# Altium schematic sheet OPTIONAL.SchDoc: 005 E-BIKE CHGARGER
size A3; Author: Oriol Cos; CompanyName: MPS; Engineer: Oriol Cos; Organization: APP BCN; Revision: V1.2; SheetNumber: 5; SheetTotal: 5
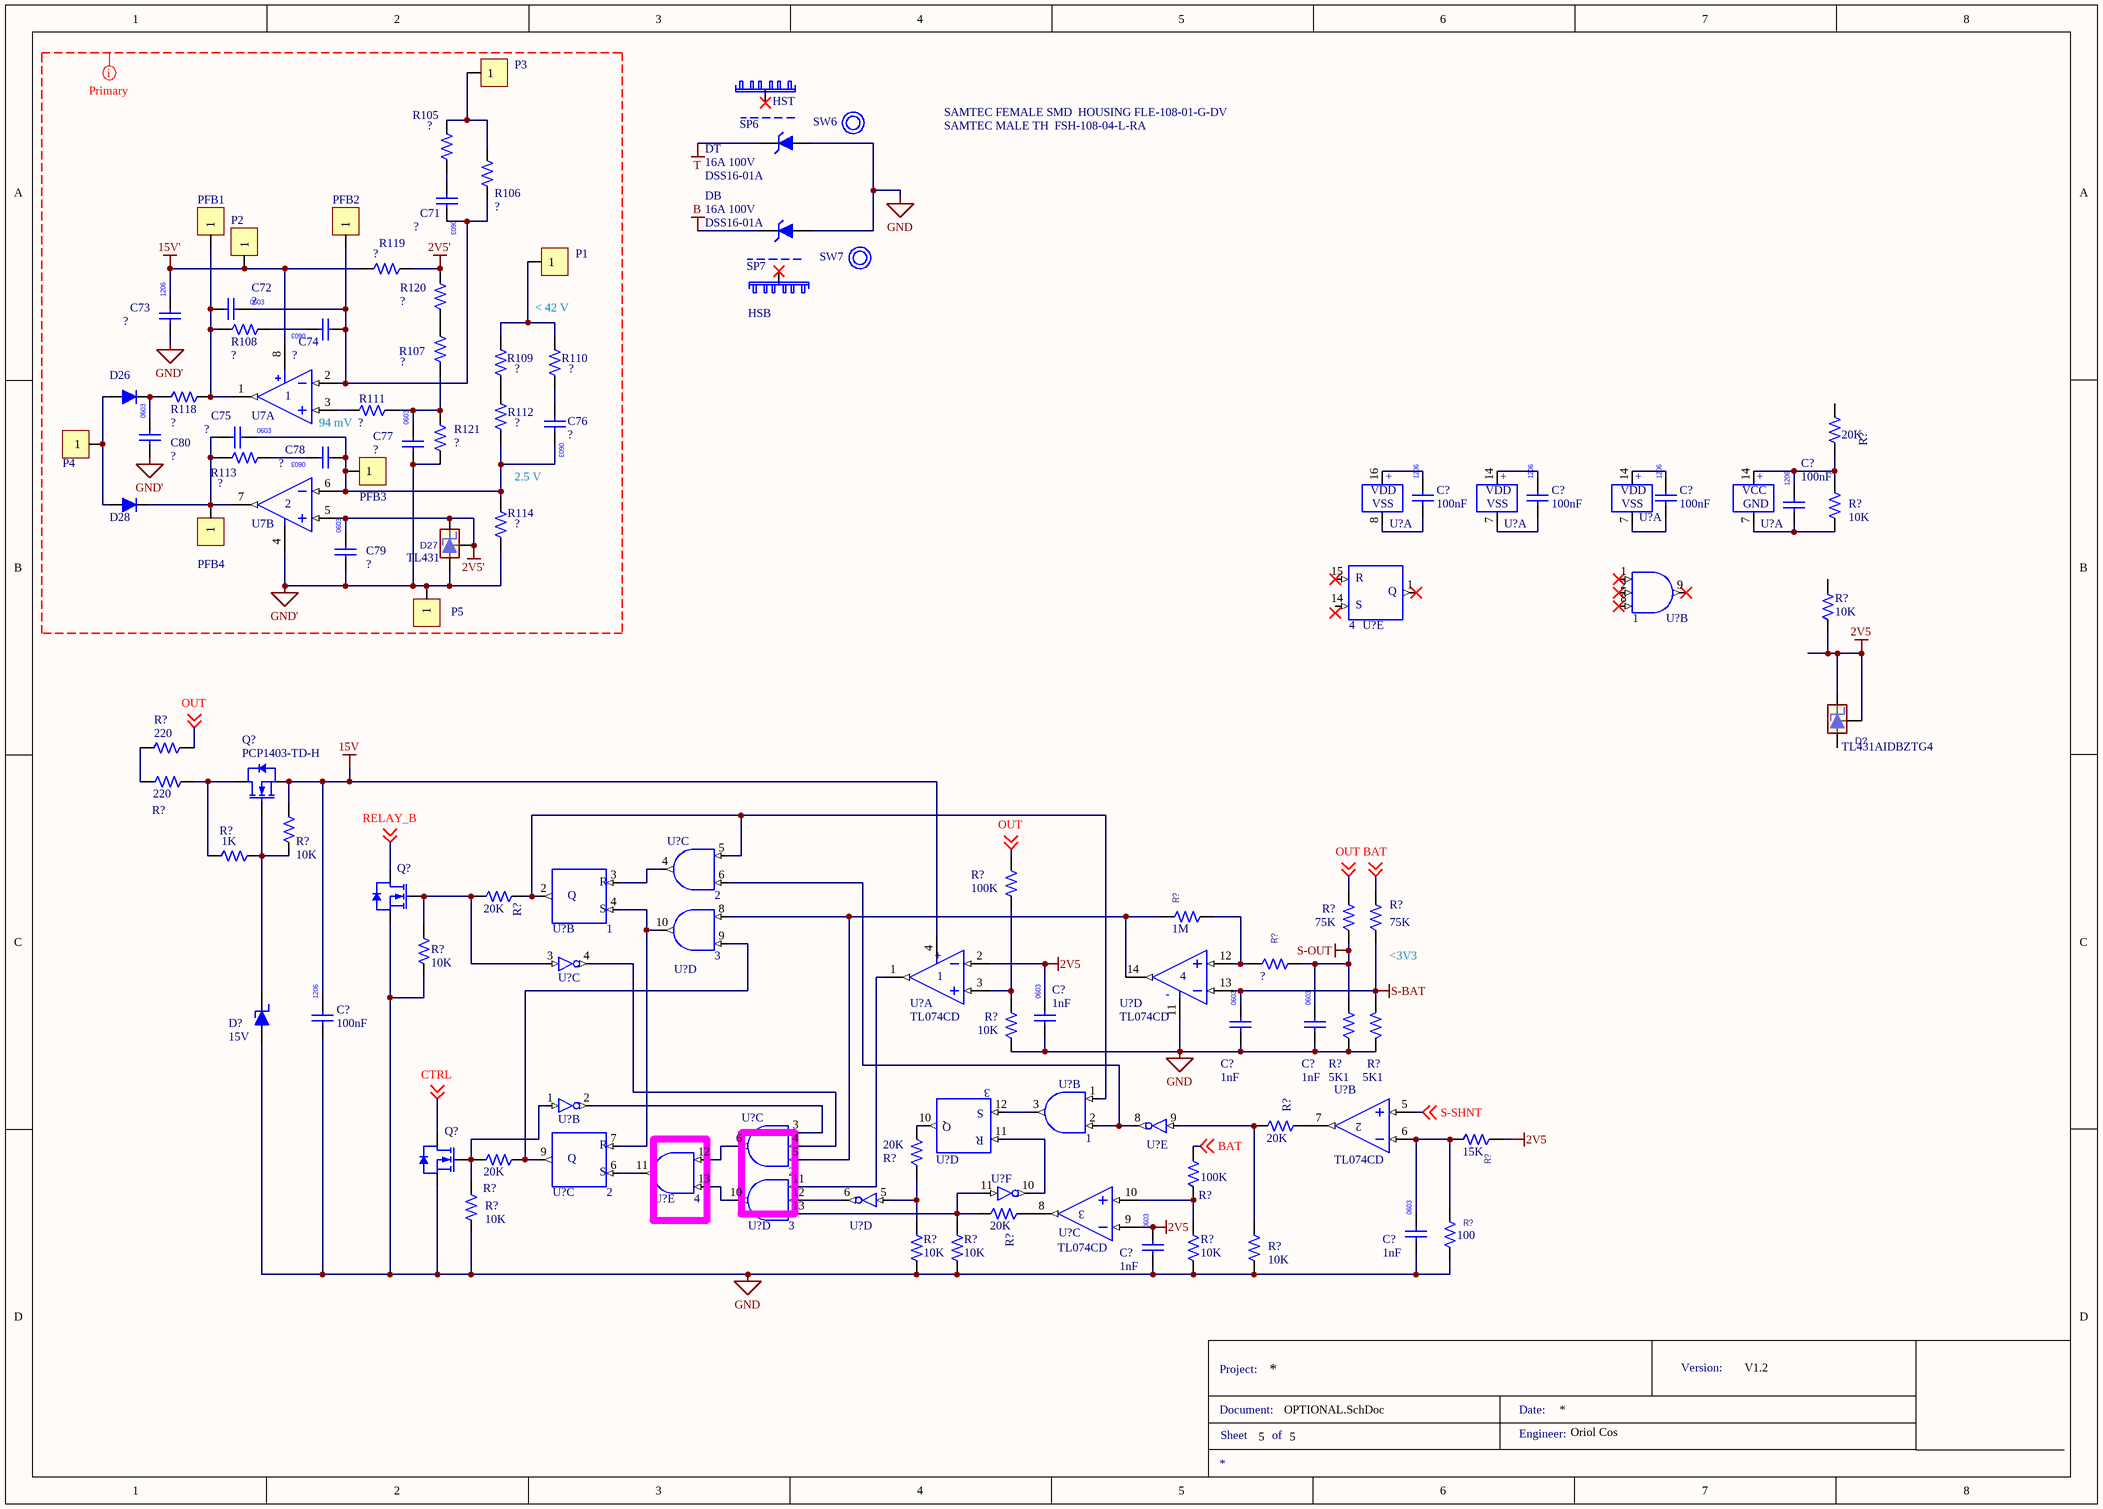
[diagram p0: OPTIONAL.SchDoc]

## Parts
(Parts that share a designator on the sheet are numbered #1, #2 ... from top to bottom, then left to right.)
C71  (no value)  [CC/NM 0603]
C72  (no value)  [CC/NM 0603]
C73  (no value)  [CC/NM 1206]
C74  (no value)  [CC/NM 0603]
C75  (no value)  [CC/NM 0603]
C76  (no value)  [CC/NM 0603]
C77  Capacitor 22nF  [CC/NM 0603]  (value not drawn)
C78  (no value)  [CC/NM 0603]
C79  (no value)  [CC/NM 0603]
C80  (no value)  [CC/NM 0603]
C?#1  value 100nF  [CC/NM 1206]
C?#2  value 100nF  [CC/NM 1206]
C?#3  value 100nF  [CC/NM 1206]
C?#4  value 100nF  [CC/NM 1206]
C?#5  value 100nF  [CC/NM 1206]
C?#6  value 1nF  [CC/NM 0603]
C?#7  value 1nF  [CC/NM 0603]
C?#8  value 1nF  [CC/NM 0603]
C?#9  value 1nF  [CC/NM 0603]
C?#10  value 1nF  [CC/NM 0603]
D26  (no value)  [SODFL260X90-2N]
D27  TL431  [SOT95P237X112-3N]
D28  (no value)  [SODFL260X90-2N]
D?#1  TL431AIDBZTG4  [SOT95P237X112-3N]
D?#2  value 15V  [SOT95P237X112-3N]
DB  value 16A 100V  Manufacturer PartNumber: DSS16-01A  [TO-220AC]
DT  value 16A 100V  Manufacturer PartNumber: DSS16-01A  [TO-220AC]
HSB  (no value)  [HS2]
HST  (no value)  [HS2]
P1  PIN  [PIN]  (value not drawn)
P2  PIN  [PIN]  (value not drawn)
P3  PIN  [PIN]  (value not drawn)
P4  PIN  [PIN]  (value not drawn)
P5  PIN  [PIN]  (value not drawn)
PFB1  PIN  [PIN]  (value not drawn)
PFB2  PIN  [PIN]  (value not drawn)
PFB3  PIN  [PIN]  (value not drawn)
PFB4  PIN  [PIN]  (value not drawn)
Q?#1  PCP1403-TD-H  [SOT89/4]
Q?#2  MVGSF1N03LT1G  [SOT95P237X112-3N]  (value not drawn)
Q?#3  MVGSF1N03LT1G  [SOT95P237X112-3N]  (value not drawn)
R105  (no value)  [CC/NM 0603]
R106  (no value)  [CC/NM 0603]
R107  (no value)  [CC/NM 0603]
R108  (no value)  [CC/NM 0603]
R109  (no value)  [CC/NM 0603]
R110  Resistor 1K  [CC/NM 0603]  (value not drawn)
R111  (no value)  [CC/NM 0603]
R112  (no value)  [CC/NM 0603]
R113  (no value)  [CC/NM 0603]
R114  (no value)  [CC/NM 0603]
R118  (no value)  [CC/NM 0603]
R119  (no value)  [CC/NM 0603]
R120  (no value)  [CC/NM 0603]
R121  (no value)  [CC/NM 0603]
R?#1  value 20K  [CC/NM 0603]
R?#2  value 10K  [CC/NM 0603]
R?#3  value 10K  [CC/NM 0603]
R?#4  value 220  [CC/NM 0603]
R?#5  value 220  [CC/NM 0603]
R?#6  value 10K  [CC/NM 0603]
R?#7  value 1K  [CC/NM 0603]
R?#8  value 100K  [CC/NM 0603]  (hidden comment: Resistor 100K)
R?#9  value 75K  [CC/NM 0603]  (hidden comment: Resistor 150K)
R?#10  value 75K  [CC/NM 0603]  (hidden comment: Resistor 150K)
R?#11  value 20K  [CC/NM 0603]
R?#12  value 1M  [CC/NM 0603]  (hidden comment: Resistor 1M)
R?#13  value 10K  [CC/NM 0603]
R?#14  Resistor 150K  [CC/NM 0603]  (value not drawn)
R?#15  value 10K  [CC/NM 0603]
R?#16  value 5K1  [CC/NM 0603]
R?#17  value 5K1  [CC/NM 0603]
R?#18  value 20K  [CC/NM 0603]
R?#19  value 15K  [CC/NM 0603]  (hidden comment: Resistor 15K)
R?#20  value 100K  [CC/NM 0603]  (hidden comment: Resistor 100K)
R?#21  value 20K  [CC/NM 0603]
R?#22  value 10K  [CC/NM 0603]
R?#23  value 20K  [CC/NM 0603]
R?#24  value 100  [CC/NM 0603]  (hidden comment: Resistor 100)
R?#25  value 20K  [CC/NM 0603]
R?#26  value 10K  [CC/NM 0603]
R?#27  value 10K  [CC/NM 0603]
R?#28  value 10K  [CC/NM 0603]
R?#29  value 10K  [CC/NM 0603]
SP6  SIL-PAD TO-220  (value not drawn)
SP7  SIL-PAD TO-220  (value not drawn)
SW6  Shoulder Washer M2.5  (value not drawn)
SW7  Shoulder Washer M2.5  (value not drawn)
U7  (no value)  [SOIC8/4.9x3.9x1.8/P1.27/L]  (parts A,B of 2)
U?#1  RS Lach  (value not drawn)  (part A of 5)
U?#2  AND Gate  (value not drawn)  (part A of 5)
U?#3  AND Gate  (value not drawn)  (part A of 4)
U?#4  Inverter  (value not drawn)  (part A of 7)
U?#5  RS Lach  (value not drawn)  (part E of 5)
U?#6  AND Gate  (value not drawn)  (part B of 4)
U?#7  AND Gate  (value not drawn)  (part C of 5)
U?#8  RS Lach  (value not drawn)  (part B of 5)
U?#9  AND Gate  (value not drawn)  (part D of 5)
U?#10  Inverter  (value not drawn)  (part C of 7)
U?#11  TL074CD  [SOIC14]  (part A of 4)
U?#12  TL074CD  [SOIC14]  (part D of 4)
U?#13  Inverter  (value not drawn)  (part B of 7)
U?#14  AND Gate  (value not drawn)  (part B of 5)
U?#15  RS Lach  (value not drawn)  (part D of 5)
U?#16  Inverter  (value not drawn)  (part E of 7)
U?#17  TL074CD  [SOIC14]  (part B of 4)
U?#18  AND Gate  (value not drawn)  (part C of 4)
U?#19  RS Lach  (value not drawn)  (part C of 5)
U?#20  AND Gate  (value not drawn)  (part E of 5)
U?#21  Inverter  (value not drawn)  (part F of 7)
U?#22  AND Gate  (value not drawn)  (part D of 4)
U?#23  Inverter  (value not drawn)  (part D of 7)
U?#24  TL074CD  [SOIC14]  (part C of 4)

## Nets
2V5: C?#6.1 C?#10.1 D?#1.1(K) D?#1.2(REF) R?#3.2 R?#19.1 U?#11.2(1IN-) U?#24.9(3IN-)
2V5': C79.1 D27.1(K) D27.2(REF) R119.2 R120.1 U7.5(2IN+)
15V: C?#5.1 Q?#1.2(SOURCE) R?#6.1 U?#11.4(VCC)
15V': C73.1 P2.1 R119.1 U7.8(VCC)
B: DB.1(K)
GND: C?#5.2 C?#6.2 C?#7.2 C?#8.2 C?#9.2 C?#10.2 D?#2.1(A) DB.2(A) DT.2(A) Q?#2.2(SOURCE) Q?#3.2(SOURCE) R?#13.2 R?#15.2 R?#16.2 R?#17.2 R?#22.2 R?#24.2 R?#26.2 R?#27.2 R?#28.2 R?#29.2 U?#12.11(-VCC)
GND': C73.2 C77.2 C79.2 C80.2 D27.3(A) P5.1 R114.1 R121.2 U7.4(GND)
S-BAT: C?#7.1 R?#10.2 R?#17.1 U?#12.13(4IN-)
S-OUT: C?#8.1 R?#9.2 R?#14.2 R?#16.1
T: DT.1(K)
BAT: R?#10.1 R?#20.1 ; off-sheet BAT
CTRL: Q?#3.3(DRAIN) ; off-sheet CTRL
OUT: R?#4.1 R?#8.1 R?#9.1 ; off-sheet OUT
RELAY_B: Q?#2.3(DRAIN) ; off-sheet RELAY_B
S-SHNT: U?#17.5(2IN+) ; off-sheet S-SHNT
NetC71_1: C71.1 C72.1 C74.2 PFB2.1 R106.1 U7.2(1IN-)
NetC71_2: C71.2 R105.1
NetC72_2: C72.2 PFB1.1 R108.1 R118.2 U7.1(1OUT)
NetC74_1: C74.1 R108.2
NetC75_1: C75.1 C76.1 C78.2 PFB3.1 R112.1 R114.2 U7.6(2IN-)
NetC75_2: C75.2 D28.1 PFB4.1 R113.1 U7.7(2OUT)
NetC76_2: C76.2 R110.1
NetC77_1: C77.1 R107.1 R111.1 R121.1
NetC78_1: C78.1 R113.2
NetC80_1: C80.1 D26.1 R118.1
NetC?#1_1: C?#1.1 U?#1.16(VDD)
NetC?#1_2: C?#1.2 U?#1.8(VSS)
NetC?#2_1: C?#2.1 U?#2.14(VDD)
NetC?#2_2: C?#2.2 U?#2.7(VSS)
NetC?#3_1: C?#3.1 U?#3.14(VDD)
NetC?#3_2: C?#3.2 U?#3.7(VSS)
NetC?#4_1: C?#4.1 R?#1.1 R?#2.1 U?#4.14(VCC)
NetC?#4_2: C?#4.2 R?#2.2 U?#4.7(GND)
NetC?#9_1: C?#9.1 R?#19.2 R?#24.1 U?#17.6(2IN-)
NetD26_2: D26.2 D28.2 P4.1
NetD?#2_3: D?#2.3(K) Q?#1.1(GATE) R?#6.2 R?#7.1
NetP1_1: P1.1 R109.2 R110.2
NetP3_1: P3.1 R105.2 R106.2
NetQ?#1_3: Q?#1.3(DRAIN) R?#5.2 R?#7.2
NetQ?#2_1: Q?#2.1(GATE) R?#11.1 R?#13.1 U?#10.3(A2)
NetQ?#3_1: Q?#3.1(GATE) R?#21.1 R?#22.1 U?#13.1(A1)
NetR107_2: R107.2 R120.2
NetR109_1: R109.1 R112.2
NetR111_2: R111.2 U7.3(1IN+)
NetR?#4_2: R?#4.2 R?#5.1
NetR?#8_2: R?#8.2 R?#15.1 U?#11.3(1IN+)
NetR?#11_2: R?#11.2 U?#7.5(C) U?#8.2(1Q) U?#14.1(A)
NetR?#12_1: R?#12.1 U?#9.8(E) U?#12.14(4OUT) U?#18.5(F)
NetR?#12_2: R?#12.2 R?#14.1 U?#12.12(4IN+)
NetR?#18_1: R?#18.1 U?#17.7(2OUT)
NetR?#18_2: R?#18.2 R?#29.1 U?#16.9(A4)
NetR?#20_2: R?#20.2 R?#28.1 U?#24.10(3IN+)
NetR?#21_2: R?#21.2 U?#9.9(F) U?#19.9(2Q)
NetR?#23_1: R?#23.1 R?#26.1 U?#23.5(A3)
NetR?#23_2: R?#23.2 U?#15.10(3Q)
NetR?#25_1: R?#25.1 U?#24.8(3OUT)
NetR?#25_2: R?#25.2 R?#27.1 U?#21.11(A5) U?#22.13(G)
NetU?#7_4: U?#7.4(K) U?#8.3(1R)
NetU?#7_6: U?#7.6(D) U?#14.2(B) U?#16.8(Y4)
NetU?#8_4: U?#8.4(1S) U?#9.10(L) U?#19.7(2R)
NetU?#10_4: U?#10.4(Y2) U?#18.4(E)
NetU?#11_1: U?#11.1(1OUT) U?#22.11(I)
NetU?#13_2: U?#13.2(Y1) U?#18.3(D)
NetU?#14_3: U?#14.3(J) U?#15.12(3S)
NetU?#15_11: U?#15.11(3R) U?#21.10(Y5)
NetU?#18_6: U?#18.6(K) U?#20.12(G)
NetU?#19_6: U?#19.6(2S) U?#20.11(M)
NetU?#20_13: U?#20.13(H) U?#22.10(L)
NetU?#22_12: U?#22.12(H) U?#23.6(Y3)

Not connected (* = marked no-connect by the designer): D?#1 3(A); HSB 0*; HST 0*; R?#1 2; R?#3 1; U?#5 1(4Q)* 14(4S) 15(4R)*; U?#6 1(A)* 2(B)* 8(C)* 9(J)*

## Layout directives
net class Primary: 2V5', 15V', GND'

## Notes on the sheet
- SAMTEC FEMALE SMD  HOUSING FLE-108-01-G-DV
- SAMTEC MALE TH  FSH-108-04-L-RA
- < 42 V
- 94 mV
- 2.5 V
- (near R?#10) <3V3
- Project:
- Version:
- Document:
- Sheet
- of
- Engineer:
- Date:
- (in symbol CD4043BD, part A) +
- (in symbol CD4043BD, part B) R; Q; S
- (in symbol CD4043BD, part C) R; Q; S
- (in symbol CD4043BD, part D) S; Q; R
- (in symbol CD4043BD, part E) R; Q; S
- (in symbol CD4073B, part A) +
- (in symbol CD4081B, part A) +
- (in symbol MC74VHCT14A, part A) +
- (in symbol TL074CD, part A) +
- (in symbol TL074CD, part D) -

## Library data of the parts
C71 C72 C75 C76 C80 = Capacitor 22nF: 22nF; Part: LLC; Comm.: Sincorpora per donar estabilitat. No molt efectiu.; CLASS: 3; Datasheet: *; Manufacturer: *; Supplier 1: *; Supplier 2: *; Supplier 1 PartNumber: *; Supplier 2 PartNumber: *; Package: 0603; Value: ?; SOURCE: HZ
  C71 C72 C80: Price 1k Ud.: 0
  C75 C76: Price 1k Ud.: 0.01
C73 C?#1-C?#5 = Capacitor 100nF: 100nF; Part: LLC; CLASS: 3; Datasheet: *; Manufacturer: *; Supplier 1: *; Supplier 2: *; Supplier 1 PartNumber: *; Supplier 2 PartNumber: *; Package: 1206; SOURCE: HZ; Price 1k Ud.: 0.01
  C73: Value: ?
C74 = Capacitor 22nF: 2.2nF; Part: LLC; CLASS: 3; Datasheet: *; Manufacturer: *; Supplier 1: *; Supplier 2: *; Supplier 1 PartNumber: *; Supplier 2 PartNumber: *; Package: 0603; Value: ?; SOURCE: HZ; Price 1k Ud.: 0.01
C77 = Capacitor 22nF: 22nF; CLASS: 3; Datasheet: *; Manufacturer: *; Supplier 1: *; Supplier 2: *; Supplier 1 PartNumber: *; Supplier 2 PartNumber: *; Package: 0603; Value: ?; Voltage: *; Type: *; Price 1k Ud.: 0.01
C78 = Capacitor 22nF: 10nF; Part: LLC; Comm.: Es canvia a 10n; CLASS: 3; Datasheet: *; Manufacturer: *; Supplier 1: *; Supplier 2: *; Supplier 1 PartNumber: *; Supplier 2 PartNumber: *; Package: 0603; Value: ?; SOURCE: HZ; Price 1k Ud.: 0.01
C79 C?#6-C?#10 = Capacitor 1nF: 1nF; Part: LLC; CLASS: 3; Datasheet: *; Manufacturer: *; Supplier 1: *; Supplier 2: *; Supplier 1 PartNumber: *; Supplier 2 PartNumber: *; Package: 0603; SOURCE: HZ; Price 1k Ud.: 0.01
  C79: Value: ?
D26 D28 = 1N4148WS: 1N4148  miniMelf Series 500 mW 100 V Max Reverse Voltage 200 mA Small Signal Diode -; Manufacturer: ON SEMICONDUCTOR; Part: LLC; CLASS: 3; Datasheet: http://www.farnell.com/datasheets/2288055.pdf?_ga=2.37780835.1791824414.1527067450-1671032910.1525848716&_gac=1.116268276.1526460935.Cj0KCQjwre_XBRDVARIsAPf7zZjUOU5-0pyrhwYQ09aPTHihSScNp-g0ngVZM5yZ5xu5MR-Mht2cpfEaAsncEALw_wcB; Supplier 1: Farnell; Supplier 2: *; Supplier 2 PartNumber: *; Package: SOD-323F; Manufacturer PartNumber: 1N4148WS; Supplier 1 PartNumber: 2453269RL; SOURCE: HZ; Price 1k Ud.: 0.01; Value: ?
D27 = TL431AIDBZTG4: TL43xx Precision Programmable Reference; Manufacturer: TEXAS INSTRUMENTS; CLASS: 3; Datasheet: http://www.ti.com/lit/ds/symlink/tl431a.pdf; Supplier 1: Farnell; Supplier 2: *; Supplier 1 PartNumber: 1494941; Supplier 2 PartNumber: *; Package: SOT-23-3; Manufacturer PartNumber: TL431AIDBZTG4; Value: ?
D?#1 = TL431AIDBZTG4: TL43xx Precision Programmable Reference; Manufacturer: TEXAS INSTRUMENTS; Value: 1494941; CLASS: 1; Comm.: MP8201; Datasheet: http://www.ti.com/lit/ds/symlink/tl431a.pdf; Supplier 1: Farnell; Supplier 2: *; Supplier 1 PartNumber: 1494941; Supplier 2 PartNumber: *; Package: SOT-23-3; Manufacturer PartNumber: TL431AIDBZTG4
D?#2 = Zener_18V: Manufacturer: ON SEMICONDUCTOR; Manufacturer PartNumber: BZX84C18LT1G; Part: LLC; CLASS: 1; Datasheet: http://www.farnell.com/datasheets/2236792.pdf?_ga=2.213210964.1976199833.1527489872-1776635558.1522923271&_gac=1.262728446.1526985275.CjwKCAjw_47YBRBxEiwAYuKdww9b6sMrV3bL46mkZpXa3C9ombUFUaiop7L4r4spXLG7BMEaHASa6xoCLfwQAvD_BwE; Package: SOT-23-3; Supplier 1: Farnell; Supplier 1 PartNumber: 1651579; SOURCE: BCN; Price 1k Ud.: 0.01
DB DT = Schotky Power Diode: Manufacturer: IXYS; Part: LLC; Datasheet: https://www.mouser.es/datasheet/2/205/L137-312501.pdf; Supplier 1: Mouser; Supplier 1 PartNumber: 747-DSS16-01A; SOURCE: BCN
HSB HST = HS2: Manufacturer: MonolithicPowerSystems; Part: LLC; CLASS: 3; Supplier 1: Farnell; Supplier 1 PartNumber: 1611441; SOURCE: TODO HZ; Price 1k Ud.: 2.0
P1-P5 PFB1-PFB4 = PIN: CLASS: 3; Value: ?
Q?#1 = PCP1403-TD-H: NMOS 60V 4.5A 117mR; Manufacturer: ON SEMICONDUCTOR; CLASS: 1; Datasheet: https://www.mouser.es/datasheet/2/308/ENA2294-D-336362.pdf; Manufacturer PartNumber: PCP1403-TD-H; Package: SOT-89-3; Supplier 1: Mouser; Supplier 1 PartNumber: 863-PCP1403-TD-H; Value: 60V 4.5A 117mR
Q?#2 Q?#3 = MVGSF1N03LT1G: NMOS 30V 2.1A  80mR; Manufacturer: ON SEMICONDUCTOR; Value: 2630354; CLASS: 1; Datasheet: http://www.farnell.com/datasheets/1749672.pdf?_ga=2.191310249.2046274455.1537515722-1776635558.1522923271; Manufacturer PartNumber: MVGSF1N03LT1G; Package: SOT-23-3; Supplier 1: Farnell; Supplier 1 PartNumber: 2630354
R105 R114 R?#3 R?#13 R?#15-R?#17 R?#28 = Resistor 10K: Resistor 0603; Part: LLC; CLASS: 3; Supplier 1 PartNumber: *; Manufacturer: *; Supplier 1: *; Package: 0603; Datasheet: *; Supplier 2 PartNumber: *; SOURCE: HZ
  R105: Value: ?; Price 1k Ud.: 0
  R114: Value: ?; Price 1k Ud.: 0.01
  R?#3 R?#13 R?#15-R?#17 R?#28: Price 1k Ud.: 0.01
R106 R111 = Resistor 10K: Resistor 0603; Part: LLC; Comm.: Es canvia  a 1k molt efectiu; CLASS: 3; Supplier 1 PartNumber: *; Manufacturer: *; Supplier 1: *; Package: 0603; Datasheet: *; Supplier 2 PartNumber: *; Value: ?; SOURCE: HZ; Price 1k Ud.: 0.01
R107 R119-R121 = Resistor 220K: Resistor 0603; Part: LLC; Comm.: Es canvia a 240K per ajustar la corrent a 5.7A; CLASS: 3; Supplier 1 PartNumber: *; Manufacturer: *; Supplier 1: *; Package: 0603; Datasheet: *; Supplier 2 PartNumber: *; Value: ?; SOURCE: HZ; Price 1k Ud.: 0.01
R108 R118 = Resistor 20K: Resistor 0603; Part: LLC; CLASS: 3; Supplier 1 PartNumber: *; Manufacturer: *; Supplier 1: *; Package: 0603; Datasheet: *; Supplier 2 PartNumber: *; Value: ?; SOURCE: HZ; Price 1k Ud.: 0.01
R109 = Resistor 8K2: Resistor 0603; Part: LLC; CLASS: 3; Supplier 1 PartNumber: *; Manufacturer: *; Supplier 1: *; Package: 0603; Datasheet: *; Supplier 2 PartNumber: *; Value: ?; SOURCE: HZ; Price 1k Ud.: 0.01
R110 = Resistor 1K: Resistor 0603; CLASS: 3; Supplier 1 PartNumber: *; Manufacturer: *; Supplier 1: *; Package: 0603; Datasheet: *; Supplier 2 PartNumber: *; Value: ?; Price 1k Ud.: 0.01
R112 = Resistor 150K: Resistor 0603; Part: LLC; CLASS: 3; Supplier 1 PartNumber: *; Manufacturer: *; Supplier 1: *; Package: 0603; Datasheet: *; Supplier 2 PartNumber: *; Value: ?; SOURCE: HZ; Price 1k Ud.: 0.01
R113 = Resistor 10K: Resistor 0603; Part: LLC; Comm.: Es canvia a 10K; CLASS: 3; Supplier 1 PartNumber: *; Manufacturer: *; Supplier 1: *; Package: 0603; Datasheet: *; Supplier 2 PartNumber: *; Value: ?; SOURCE: HZ; Price 1k Ud.: 0.01
R?#1 R?#4-R?#7 R?#11 R?#18 R?#21 R?#23 R?#25 = Resistor 1K: Resistor 0603; Part: LLC; CLASS: 3; Supplier 1 PartNumber: *; Manufacturer: *; Supplier 1: *; Package: 0603; Datasheet: *; Supplier 2 PartNumber: *; SOURCE: HZ; Price 1k Ud.: 0.01
R?#2 R?#22 R?#26 R?#27 R?#29 = Resistor 10K: Resistor 0603; Part: LLC; Comm.: Es canvia a 1kl molt effectiiu; CLASS: 3; Supplier 1 PartNumber: *; Manufacturer: *; Supplier 1: *; Package: 0603; Datasheet: *; Supplier 2 PartNumber: *; SOURCE: HZ; Price 1k Ud.: 0.01
R?#8 R?#20 = Resistor 100K: Resistor 0603; Supplier 1 PartNumber: *; Manufacturer: *; Supplier 1: *; Package: 0603; Datasheet: *; Supplier 2 PartNumber: *
R?#9 R?#10 = Resistor 150K: Resistor 0603; Supplier 1 PartNumber: *; Manufacturer: *; Supplier 1: *; Package: 0603; Datasheet: *; Supplier 2 PartNumber: *
R?#12 = Resistor 1M: Resistor 0603; Supplier 1 PartNumber: *; Manufacturer: *; Supplier 1: *; Package: 0603; Datasheet: *; Supplier 2 PartNumber: *
R?#14 = Resistor 150K: Resistor 0603; CLASS: 3; Supplier 1 PartNumber: *; Manufacturer: *; Supplier 1: *; Package: 0603; Datasheet: *; Supplier 2 PartNumber: *; Value: ?
R?#19 = Resistor 15K: Resistor 0603; Supplier 1 PartNumber: *; Manufacturer: *; Supplier 1: *; Package: 0603; Datasheet: *; Supplier 2 PartNumber: *
R?#24 = Resistor 100: Resistor 0603; Supplier 1 PartNumber: *; Manufacturer: *; Supplier 1: *; Package: 0603; Datasheet: *; Supplier 2 PartNumber: *
SP6 SP7 = SIL-PAD TO-220: Sil-Pad 2000 es un aislador de conducción térmica de alto rendimiento diseñado para aplicaciones exigentes de tipo militar / aeroespacial y comercial. Sil-Pad 2000 cumple con: MIL-M-38527/8A, MIL-M-38527C y MIL-I-49456. / Fiabilidad y rendimiento óptimos / Aislamiento eléctrico de 4kV (mínimo) / Limpio, sin grasa y flexible / Elastómero de silicona cargado de nitruro de boro / Pre-cortado para transistores, o en lámina no cortada; Manufacturer: BERGQUIST; Manufacturer PartNumber: 2015-54; Value: 3.5W/m.K 4kV; Datasheet: http://www.farnell.com/datasheets/49499.pdf?_ga=2.194756708.870501412.1538985677-1776635558.1522923271; Package: TO-220; Supplier 1: Farnell; Supplier 1 PartNumber: 681118
SW6 SW7 = Shoulder Washer M2.5: Manufacturer: Keystone; Manufacturer PartNumber: 3103; Datasheet: https://www.mouser.es/datasheet/2/215/103-744481.pdf; Package: M2; Supplier 1: Mouser; Supplier 1 PartNumber: 534-3103
U7 = LM358: Manufacturer: TI; Part: LLC; Value: 7527007; CLASS: 3; Datasheet: http://www.ti.com/lit/ds/symlink/lm358.pdf; Manufacturer PartNumber: LM358; Package: SOIC-8; Supplier 1: Farnell; Supplier 1 PartNumber: 7527007; SOURCE: BCN; Price 1k Ud.: 0.08
U?#1 U?#5 U?#8 U?#15 U?#19 = CD4043BD: CMOS Quat 3-State RS Laches; Datasheet: http://www.ti.com/lit/ds/symlink/cd4043b.pdf
U?#2 U?#7 U?#9 U?#14 U?#20 = CD4073B: Dual (4) Input AND Gate; Datasheet: http://www.ti.com/lit/ds/symlink/cd4081b-mil.pdf
U?#3 U?#6 U?#18 U?#22 = CD4081B: Triple (3) Input AND Gate; Datasheet: http://www.ti.com/lit/ds/symlink/cd4081b-mil.pdf
U?#4 U?#10 U?#13 U?#16 U?#21 U?#23 = MC74VHCT14A: Hex Schmitt Inverter. VCC 5V; Datasheet: https://www.mouser.es/datasheet/2/308/MC74VHCT14A-D-1387835.pdf
U?#11 U?#12 U?#17 U?#24 = TL074CD: 3 MHz, 13 V/µs, 7V a 36V; Manufacturer: TEXAS INSTRUMENTS; Value: 1103010; CLASS: 1; Datasheet: http://www.ti.com/lit/ds/symlink/tl074.pdf; Manufacturer PartNumber: TL074CD; Package: SOIC-14; Supplier 1: Farnell; Supplier 1 PartNumber: 1103010